# Altium project CurrentSensingTestBoard.PrjPcb
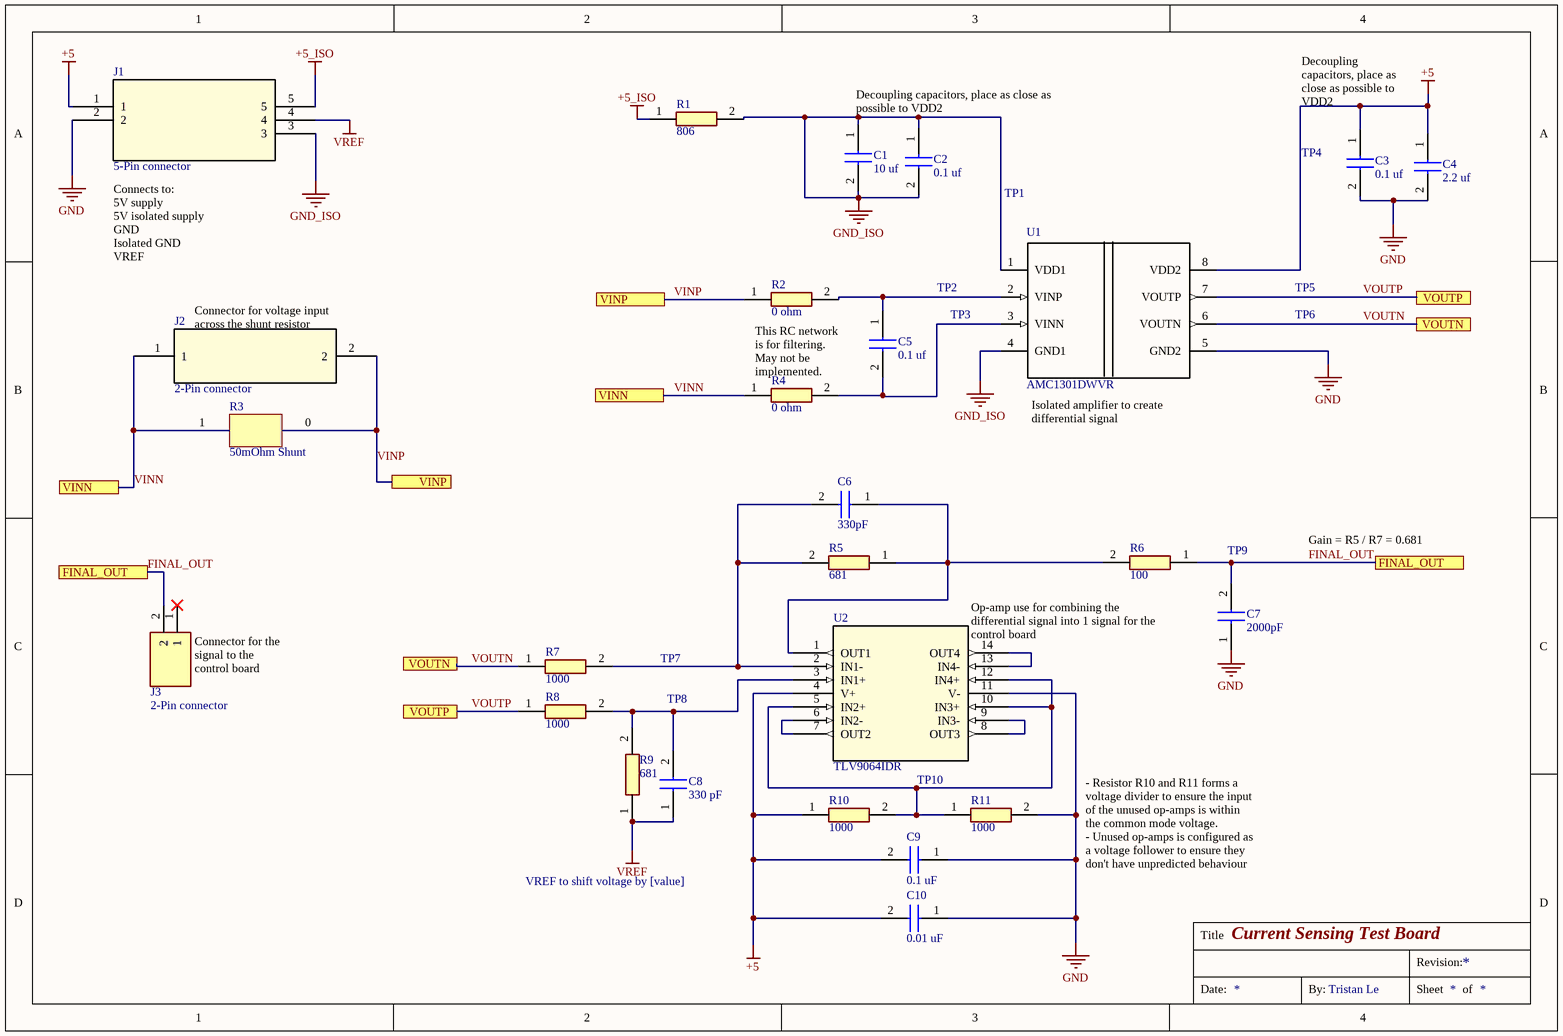
[diagram p0: Current Sensing.SchDoc]
1 sheet, 26 parts. Net scope: flat (ports and power ports of the same name join across sheets).
Board file: Current Sensing.PcbDoc

## Sheet Current Sensing.SchDoc: Current Sensing Test Board
size A4; Author: Tristan Le; AuthorBy: Tristan Le

### Parts
C1  10 uf  [CC0805N]
C2  0.1 uf  [CC0805N]
C3  0.1 uf  [CC0805N]
C4  2.2 uf  [CC0805N]
C5  0.1 uf  [CC0805N]
C6  330pF  [CC0805N]
C7  2000pF  [CC0805N]
C8  330 pF  [CC0805N]
C9  0.1 uF  [CC0805N]
C10  0.01 uF  [CC0805N]
J1  5-Pin connector  [282836-5]
J2  2-Pin connector  [282837-2]
J3  2-Pin connector  [SHDR2W64P0X250_1X2_740X575X700P]
R1  806  [RESC0603X26N]
R2  0 ohm  [RESC0603X26N]
R3  50mOhm Shunt  [R_Shunt]
R4  0 ohm  [RESC0603X26N]
R5  681  [RESC0603X26N]
R6  100  [RESC0603X26N]
R7  1000  [RESC0603X26N]
R8  1000  [RESC0603X26N]
R9  681  [RESC0603X26N]
R10  1000  [RESC0603X26N]
R11  1000  [RESC0603X26N]
U1  AMC1301DWVR  [DWV0008A]
U2  TLV9064IDR  [D14]

### Ports
FINAL_OUT, VINN, VINP, VOUTN, VOUTP

### Nets
+5: C3.1 C4.1 C9.2 C10.2 J1.1 R10.1 U1.8(VDD2) U2.4(V+)
+5_ISO: J1.5 R1.1
GND: C3.2 C4.2 C7.1 C9.1 C10.1 J1.2 R11.2 U1.5(GND2) U2.11(V-)
GND_ISO: C1.1 C1.2 C2.1 C2.2 J1.3 R1.2 U1.1(VDD1) U1.4(GND1)
VREF: C8.1 J1.4 R9.1
FINAL_OUT: C7.2 J3.2 R6.1 ; port FINAL_OUT
VINN: J2.1 R3.1 R4.1 ; port VINN
VINP: J2.2 R2.1 R3.0 ; port VINP
VOUTN: R7.1 U1.6(VOUTN) ; port VOUTN
VOUTP: R8.1 U1.7(VOUTP) ; port VOUTP
NetC5_1: C5.1 R2.2 U1.2(VINP)
NetC5_2: C5.2 R4.2 U1.3(VINN)
NetC6_1: C6.1 R5.1 R6.2 U2.1(OUT1)
NetC6_2: C6.2 R5.2 R7.2 U2.2(IN1-)
NetC8_2: C8.2 R8.2 R9.2 U2.3(IN1+)
NetR10_2: R10.2 R11.1 U2.5(IN2+) U2.10(IN3+) U2.12(IN4+)
NetU2_6: U2.6(IN2-) U2.7(OUT2)
NetU2_8: U2.8(OUT3) U2.9(IN3-)
NetU2_13: U2.13(IN4-) U2.14(OUT4)

Not connected (* = marked no-connect by the designer): J3 1*

### Notes on the sheet
- Decoupling capacitors, place as close as possible to VDD2
- (near C3) TP4
- TP1
- (near J1) Connects to:
  5V supply
  5V isolated supply
  GND
  Isolated GND
  VREF
- TP2
- TP5
- (near J2) Connector for voltage input across the shunt resistor
- This RC network is for filtering. May not be implemented.
- TP3
- TP6
- (near U1) Isolated amplifier to create differential signal
- TP9
- Gain = R5 / R7 = 0.681
- (near U2) Op-amp use for combining the differential signal into 1 signal for the control board
- (near J3) Connector for the signal to the control board
- TP7
- TP8
- TP10
- VREF to shift voltage by [value]
- - Resistor R10 and R11 forms a voltage divider to ensure the input of the unused op-amps is within the common mode voltage.
  - Unused op-amps is configured as a voltage follower to ensure they don't have unpredicted behaviour
- Title
- Revision:
- Date:
- By:
- Sheet
- of

### Library data of the parts
C1-C10 = C0805C104K5RACTU: Capacitor; Manufacturer_Name: Kemet; Datasheet Link: http://docs-emea.rs-online.com/webdocs/134c/0900766b8134ce68.pdf; Height: 0.88mm; Manufacturer_Part_Number: C0805C104K5RACTU; Mouser Part Number: 80-C0805C104K5R; Mouser Price/Stock: https://www.mouser.com/Search/Refine.aspx?Keyword=80-C0805C104K5R; RS Part Number: 2644416P; RS Price/Stock: http://uk.rs-online.com/web/p/products/2644416P
J1 = 282836-5: No Description Available; Vendor: TE Connectivity; Built_By: EMA_UL_Team; Manufacturer_Part_Number: 282836-5; Copyright: Copyright (C) 2018 Accelerated Designs. All rights reserved; RefDes: RefDes; Type: DEV; Value: Value
J2 = 282837-2: No Description Available; Vendor: TE Connectivity; Built_By: EMA_UL_Team; Manufacturer_Part_Number: 282837-2; Copyright: Copyright (C) 2018 Accelerated Designs. All rights reserved; RefDes: RefDes; Type: DEV; Value: Value
J3 = B2B-XH-A(LF)(SN): Connector; Manufacturer_Name: JST Sales America; Datasheet Link: http://www.jst-mfg.com/product/pdf/eng/eXH.pdf; Height: 7mm; Manufacturer_Part_Number: B2B-XH-A(LF)(SN)
R1 R2 R4-R11 = RC0201JR-0710RL: Resistor; Manufacturer_Name: YAGEO (PHYCOMP); Datasheet Link: http://www.yageo.com/documents/recent/PYu-RC0201_51_RoHS_L_8.pdf; Height: 0.26mm; Manufacturer_Part_Number: RC0201JR-0710RL; Mouser Part Number: 603-RC0201JR-0710RL; Mouser Price/Stock: https://www.mouser.com/Search/Refine.aspx?Keyword=603-RC0201JR-0710RL
R3 = R_SHUNT: 50 mOhms ±1% 10W Chip Resistor; Resistance: 50 mOhm
U1 = AMC1301DWVR: No Description Available; Vendor: Texas Instruments; Built_By: Texas_Instrument_Team; Manufacturer_Part_Number: AMC1301DWVR; Copyright: Copyright (C) 2018 Accelerated Designs. All rights reserved; RefDes: RefDes; Type: DEV; Value: Value
U2 = TLV9064IDR: No Description Available; Vendor: Texas Instruments; Manufacturer_Part_Number: TLV9064IDR; Copyright: Copyright (C) 2016 Accelerated Designs. All rights reserved; RefDes: RefDes; Type: DEV; Value: Value

## Assembly variants
Variant of Current Sensing Test Board: not fitted C5